# EasyEDA Pro project Syntheseproject_Elektronisch_Schema_2025-.epro

# Schematic Schematic1
Board Name: Board1; Create Date: 2025-12-01; Page Name: P1; Project Name: Syntheseproject 25-26; Schematic Name: Schematic1; Update Date: 2025-12-01; Company: EasyEDA.com; Page Size: A4; Version: V1.0
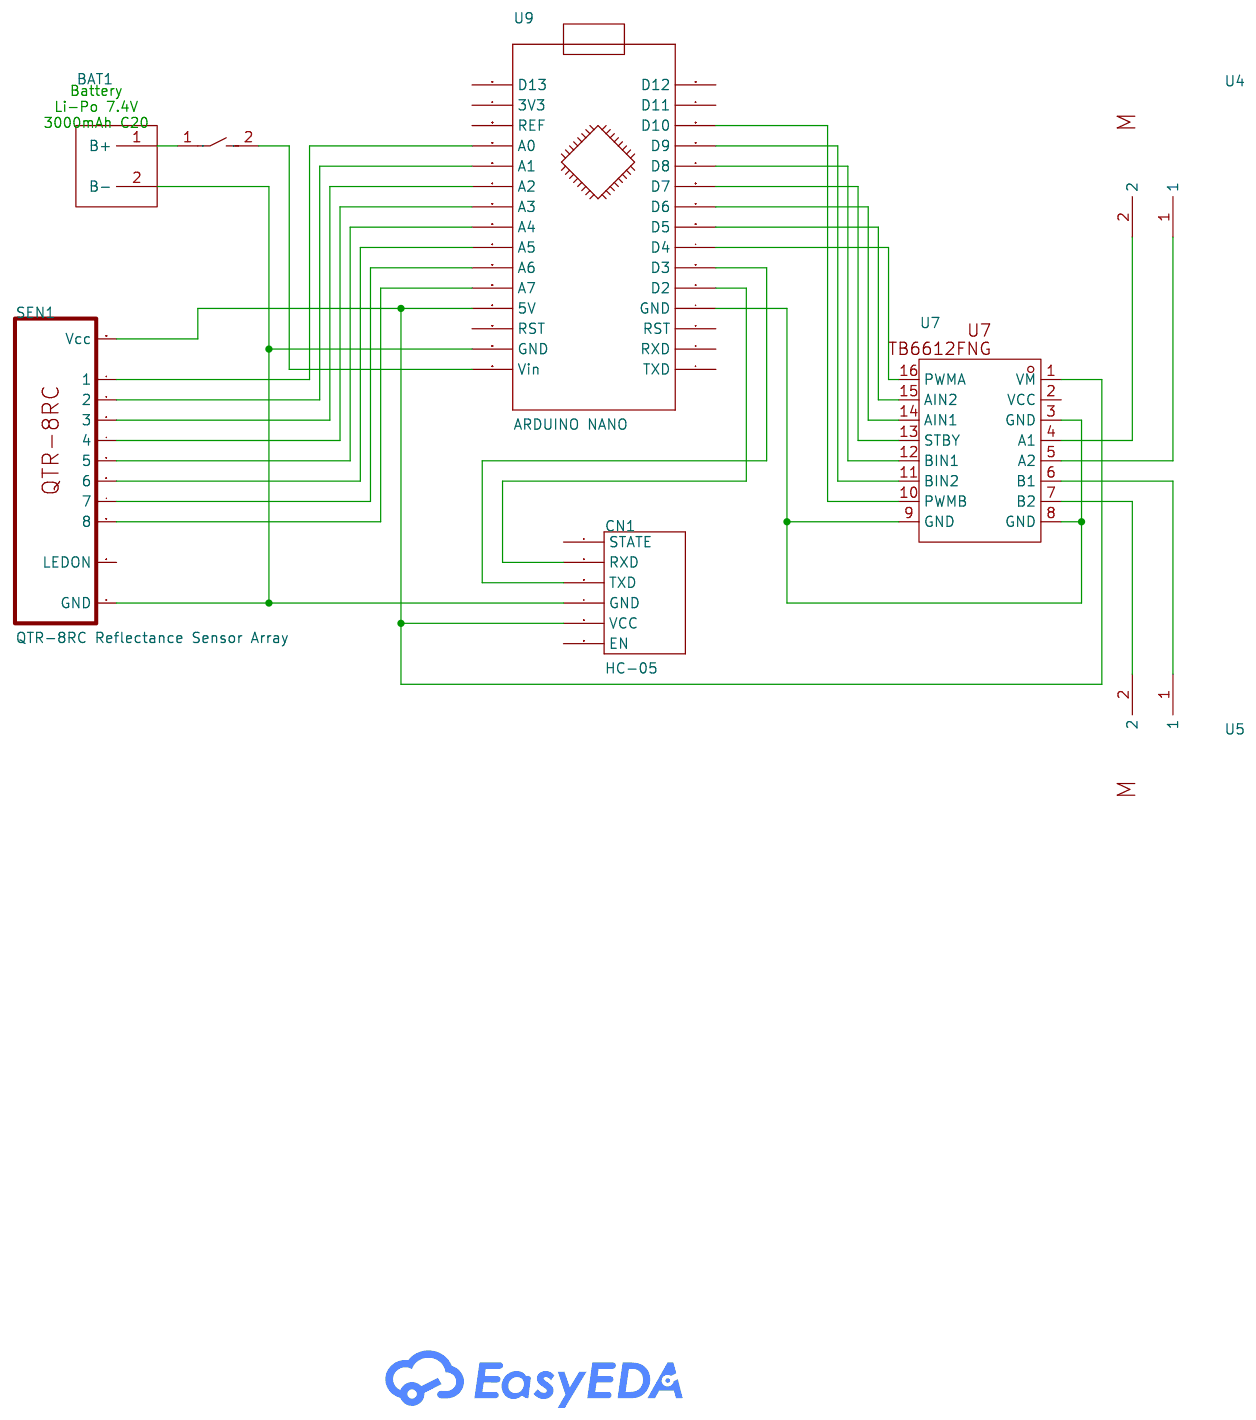
[diagram p0: schematic sheet]

## Parts
BAT1  LiPo_7.4V_3000mAh_C20
CN1  HC-05  [H6-2.54]
SEN1  QTR-8RC Reflectance Sensor Array  [QTR-8X]
U4  DC-MOTOR-GA12-N20
U5  DC-MOTOR-GA12-N20
U7  TB6612FNG SPARKFUN  [TB6612FNG]
U8  02-48-03-0004-00  [KEY-SMD_L6.0-W3.5-LS8.0-1]
U9  ARDUINO NANO

## Library data of the parts
BAT1 = Battery_LiPo_7.4V_3000mAh
CN1 = HC-05: DIP-Black-Female-Header-VERT(6P); Manufacturer Part: F185-1106A1BSYC1
SEN1 = QTR-8RC Reflectance Sensor Array: Manufacturer: Pololu; Supplier: Pololu; Supplier Part: 961; link: https://www.pololu.com/product/961
U4 U5 = DC-MOTOR-GA12-N20: Supplier Part: GA12-N20; link: https://nl.aliexpress.com/item/4000311295036.html?spm=a2g0o.order_list.order_list_main.51.2c0679d23PHJcZ&gatewayAdapt=glo2nld
U7 = TB6612FNG SPARKFUN: 3DModel: TB6612FNG MODULO COPY
U8 = 02-48-03-0004-00: Supplier Part: C9900014407; Supplier Footprint: SWITCH2-01; JLCPCB Part Class: Extended Part; Supplier: LCSC
U9 = ARDUINO NANO: Manufacturer Part: ?

## Nets
Net-(BAT1-1): BAT1.1(B+) U8.1
Net-(BAT1-2): BAT1.2(B-) CN1.4(GND) SEN1.11(GND) U9.29(GND)
Net-(CN1-2): CN1.2(RXD) U9.5(D2)
Net-(CN1-3): CN1.3(TXD) U9.6(D3)
Net-(CN1-5): CN1.5(VCC) SEN1.10(Vcc) U7.1(VM) U9.27(5V)
Net-(SEN1-1): SEN1.1 U9.19(A0)
Net-(SEN1-2): SEN1.2 U9.20(A1)
Net-(SEN1-3): SEN1.3 U9.21(A2)
Net-(SEN1-4): SEN1.4 U9.22(A3)
Net-(SEN1-5): SEN1.5 U9.23(A4)
Net-(SEN1-6): SEN1.6 U9.24(A5)
Net-(SEN1-7): SEN1.7 U9.25(A6)
Net-(SEN1-8): SEN1.8 U9.26(A7)
Net-(U4-1): U4.1 U7.5(A2)
Net-(U4-2): U4.2 U7.4(A1)
Net-(U5-1): U5.1 U7.6(B1)
Net-(U5-2): U5.2 U7.7(B2)
Net-(U7-3): U7.3(GND) U7.8(GND) U7.9(GND) U9.4(GND)
Net-(U7-10): U7.10(PWMB) U9.13(D10)
Net-(U7-11): U7.11(BIN2) U9.12(D9)
Net-(U7-12): U7.12(BIN1) U9.11(D8)
Net-(U7-13): U7.13(STBY) U9.10(D7)
Net-(U7-14): U7.14(AIN1) U9.9(D6)
Net-(U7-15): U7.15(AIN2) U9.8(D5)
Net-(U7-16): U7.16(PWMA) U9.7(D4)
Net-(U8-2): U8.2 U9.30(Vin)

Not connected (* = marked no-connect by the designer): CN1 1(STATE) 6(EN); SEN1 9(LEDON); U7 2(VCC); U9 1(TXD) 2(RXD) 3(RST) 14(D11) 15(D12) 16(D13) 17(3V3) 18(REF) 28(RST)
